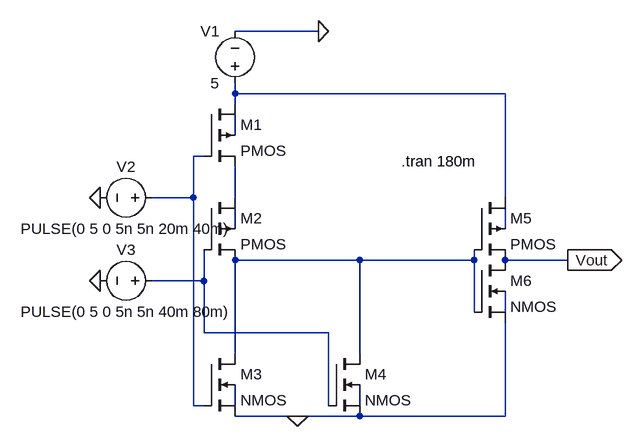
[diagram p0: schematic OR.asc]
OR.asc, the LTspice schematic file:
Version 4
SHEET 1 880 680
WIRE -256 -320 -384 -320
WIRE -384 -224 -384 -240
WIRE 32 -224 -384 -224
WIRE -384 -208 -384 -224
WIRE -384 -160 -384 -192
WIRE -432 -128 -448 -128
WIRE -448 -64 -448 -128
WIRE -448 -64 -512 -64
WIRE -384 -64 -384 -112
WIRE 32 -64 32 -224
WIRE -384 -16 -384 -48
WIRE 32 -16 32 -48
WIRE -192 32 -384 32
WIRE -16 32 -16 16
WIRE -16 32 -192 32
WIRE 128 32 32 32
WIRE -432 64 -432 16
WIRE -432 64 -512 64
WIRE -16 112 -16 32
WIRE 32 112 32 80
WIRE -432 144 -432 64
WIRE -240 144 -432 144
WIRE -384 176 -384 32
WIRE -192 176 -192 32
WIRE -448 256 -448 -64
WIRE -432 256 -448 256
WIRE -384 256 -384 224
WIRE -240 256 -240 144
WIRE -192 256 -192 224
WIRE -288 272 -384 272
WIRE -192 272 -288 272
WIRE 32 272 32 128
WIRE 32 272 -192 272
FLAG -256 -320 0
FLAG -288 272 0
FLAG -592 -64 0
FLAG -592 64 0
FLAG 128 32 Vout
IOPIN 128 32 Out
SYMBOL pmos4 -432 -208 R0
SYMATTR InstName M1
SYMBOL pmos4 -432 -64 R0
SYMATTR InstName M2
SYMBOL nmos4 -432 176 R0
SYMATTR InstName M3
SYMBOL nmos4 -240 176 R0
SYMATTR InstName M4
SYMBOL voltage -384 -224 R180
WINDOW 0 24 96 Left 2
WINDOW 3 24 16 Left 2
WINDOW 123 0 0 Left 0
WINDOW 39 0 0 Left 0
SYMATTR InstName V1
SYMATTR Value 5
SYMBOL voltage -496 -64 R90
WINDOW 0 -32 56 VBottom 2
WINDOW 3 32 56 VTop 2
WINDOW 123 0 0 Left 0
WINDOW 39 0 0 Left 0
SYMATTR InstName V2
SYMATTR Value PULSE(0 5 0 5n 5n 20m 40m)
SYMBOL voltage -496 64 R90
WINDOW 0 -32 56 VBottom 2
WINDOW 3 32 56 VTop 2
WINDOW 123 0 0 Left 0
WINDOW 39 0 0 Left 0
SYMATTR InstName V3
SYMATTR Value PULSE(0 5 0 5n 5n 40m 80m)
SYMBOL pmos4 -16 -64 R0
SYMATTR InstName M5
SYMBOL nmos4 -16 32 R0
SYMATTR InstName M6
TEXT -128 -120 Left 2 !.tran 180m

The netlist it stands for:
* OR.asc
M1 N001 N003 N004 N002 PMOS
M2 N004 N008 N007 N005 PMOS
M3 N007 N003 0 N010 NMOS
M4 N007 N008 0 N011 NMOS
V1 N001 0 5
V2 N003 0 PULSE(0 5 0 5n 5n 20m 40m)
V3 N008 0 PULSE(0 5 0 5n 5n 40m 80m)
M5 N001 N007 Vout N006 PMOS
M6 Vout N007 0 N009 NMOS
.model NMOS NMOS
.model PMOS PMOS
.lib standard.mos
.tran 180m
.backanno
.end